# EAGLE design ADC_Block (EAGLE 7.2.0)

## Sheet 1 of 2
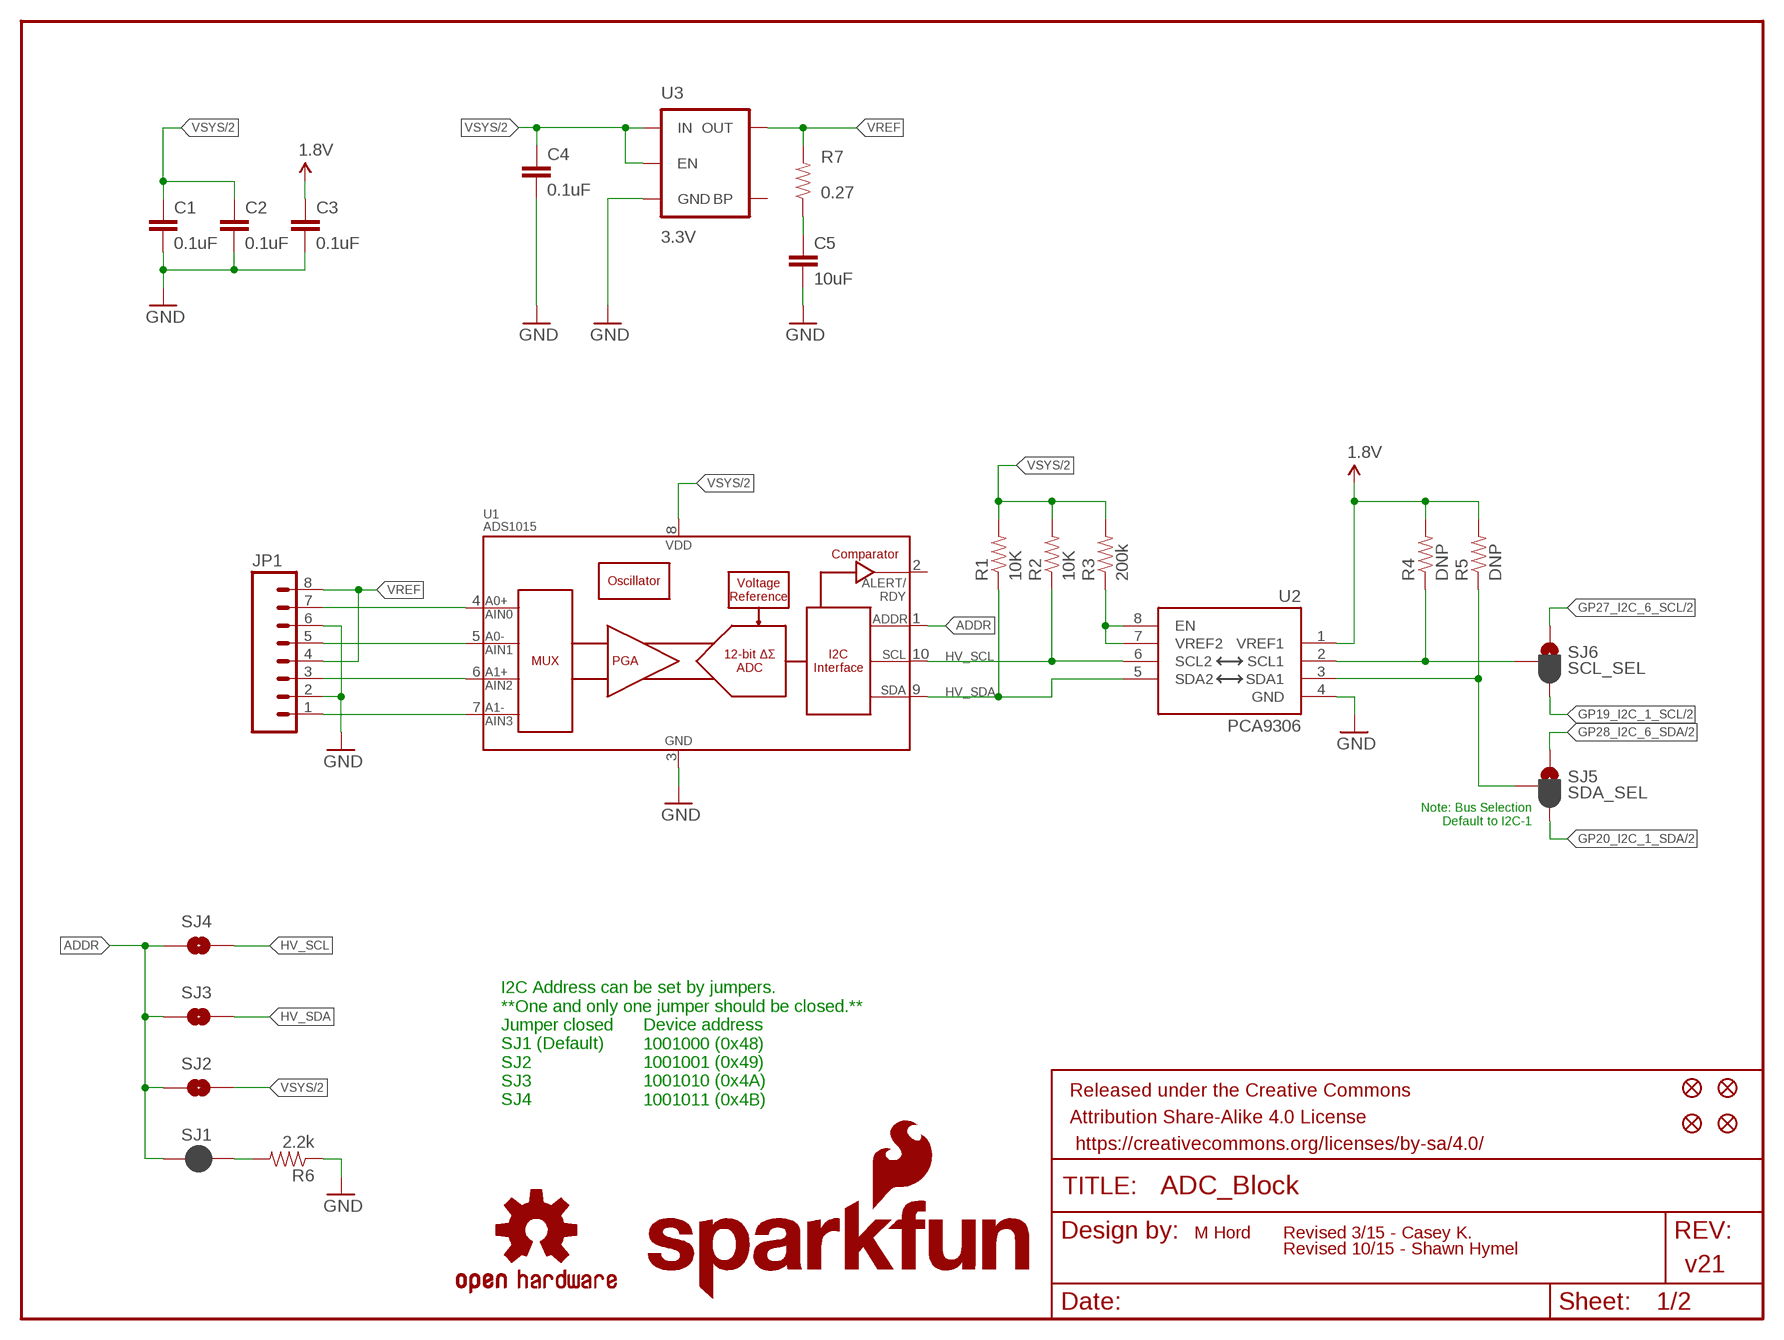
[diagram p0: schematic, sheet 1]

### Parts
C1  0.1uF  0.1UF-25V(+80/-20%)(0603)  [0603-CAP]
C2  0.1uF  0.1UF-25V(+80/-20%)(0603)  [0603-CAP]
C3  0.1uF  0.1UF-25V(+80/-20%)(0603)  [0603-CAP]
C4  0.1uF  0.1UF-25V(+80/-20%)(0603)  [0603-CAP]
C5  10uF  10UF10V10%(0805)  [0805-CAP]
FID1  FIDUCIAL1X2  [FIDUCIAL-1X2]
FID2  FIDUCIAL1X2  [FIDUCIAL-1X2]
FID3  FIDUCIAL1X2  [FIDUCIAL-1X2]
FID4  FIDUCIAL1X2  [FIDUCIAL-1X2]
FRAME1  FRAME-LETTER  [CREATIVE_COMMONS]
JP1  M08LOCK  [1X08_LOCK]
LOGO1  SFE_LOGO_NAME_FLAME.1_INCH  [SFE_LOGO_NAME_FLAME_.1]
LOGO2  OSHW-LOGOS  [OSHW-LOGO-S]
LOGO3  SFE_LOGO_NAME_FLAME.1_INCH  [SFE_LOGO_NAME_FLAME_.1]
LOGO4  OSHW-LOGOS  [OSHW-LOGO-S]
R1  10K  10KOHM-1/10W-1%(0603)0603  [0603-RES]
R2  10K  10KOHM-1/10W-1%(0603)0603  [0603-RES]
R3  200k  200KOHM1/10W1%(0603)200K  [0603-RES]
R4  DNP  2.2KOHM-1/10W-1%(0603)  [0603-RES]
R5  DNP  2.2KOHM-1/10W-1%(0603)  [0603-RES]
R6  2.2k  2.2KOHM-1/10W-1%(0603)  [0603-RES]
R7  0.27  0.27OHM-1/10W-1%(0603)  [0603-RES]
SJ1  JUMPER-PAD-2-NC_BY_PASTE  [PAD-JUMPER-2-NC_BY_PASTE_YES_SILK]
SJ2  JUMPER-PAD-2-NOYES_SILK  [PAD-JUMPER-2-NO_YES_SILK]
SJ3  JUMPER-PAD-2-NOYES_SILK  [PAD-JUMPER-2-NO_YES_SILK]
SJ4  JUMPER-PAD-2-NOYES_SILK  [PAD-JUMPER-2-NO_YES_SILK]
SJ5  SDA_SEL  JUMPER-PAD-3-2OF3_NC_BY_PASTE  [PAD-JUMPER-3-2OF3_NC_BY_PASTE_YES_SILK_FULL_BOX]
SJ6  SCL_SEL  JUMPER-PAD-3-2OF3_NC_BY_PASTE  [PAD-JUMPER-3-2OF3_NC_BY_PASTE_YES_SILK_FULL_BOX]
U1  ADS1015  [MSOP10]
U2  PCA9306  PCA9306PCA9306DC-1:1  [PCA9306DC-1:1]
U3  3.3V  MIC52053.3V  [SOT23-5]

### Nets
1.8V: C3.1 R4.2 R5.2 U2.1(VREF1) ; also sheet 2
A0+/AIN0: JP1.7 U1.4(AIN0)
A0-/AIN1: JP1.5 U1.5(AIN1)
A1+/AIN2: JP1.3 U1.6(AIN2)
A1-/AIN3: JP1.1 U1.7(AIN3)
ADDR: SJ1.1 SJ2.1 SJ3.1 SJ4.1 U1.1(ADDR)
GND: C1.2 C2.2 C3.2 C4.2 C5.2 JP1.2 JP1.6 R6.1 U1.3(VSS) U2.4(GND) U3.2(GND) ; also sheet 2
GP19_I2C_1_SCL: SJ6.3 ; also sheet 2
GP20_I2C_1_SDA: SJ5.3 ; also sheet 2
GP27_I2C_6_SCL: SJ6.1 ; also sheet 2
GP28_I2C_6_SDA: SJ5.1 ; also sheet 2
HV_SCL: R2.1 SJ4.2 U1.10(SCL) U2.6(SCL2)
HV_SDA: R1.1 SJ3.2 U1.9(SDA) U2.5(SDA2)
N$1: R3.1 U2.7(VREF2) U2.8(EN)
N$2: R4.1 SJ6.2 U2.2(SCL1)
N$3: R6.2 SJ1.2
N$4: R5.1 SJ5.2 U2.3(SDA1)
N$5: C5.1 R7.1
VREF: JP1.4 JP1.8 R7.2 U3.5(OUT)
VSYS: C1.1 C2.1 C4.1 R1.2 R2.2 R3.2 SJ2.2 U1.8(VDD) U3.1(IN) U3.3(EN) ; also sheet 2
Unconnected: U1.2(ALERT/RDY) U3.4(BP)

### Notes on the sheet
- Note: Bus Selection
  Default to I2C-1
- I2C Address can be set by jumpers.
  **One and only one jumper should be closed.**
  Jumper closed
  SJ1 (Default)
  SJ2
  SJ3
  SJ4
- Device address
  1001000 (0x48)
  1001001 (0x49)
  1001010 (0x4A)
  1001011 (0x4B)
- M Hord | Revised 3/15 - Casey K.
- Revised 10/15 - Shawn Hymel
- v21

## Sheet 2 of 2
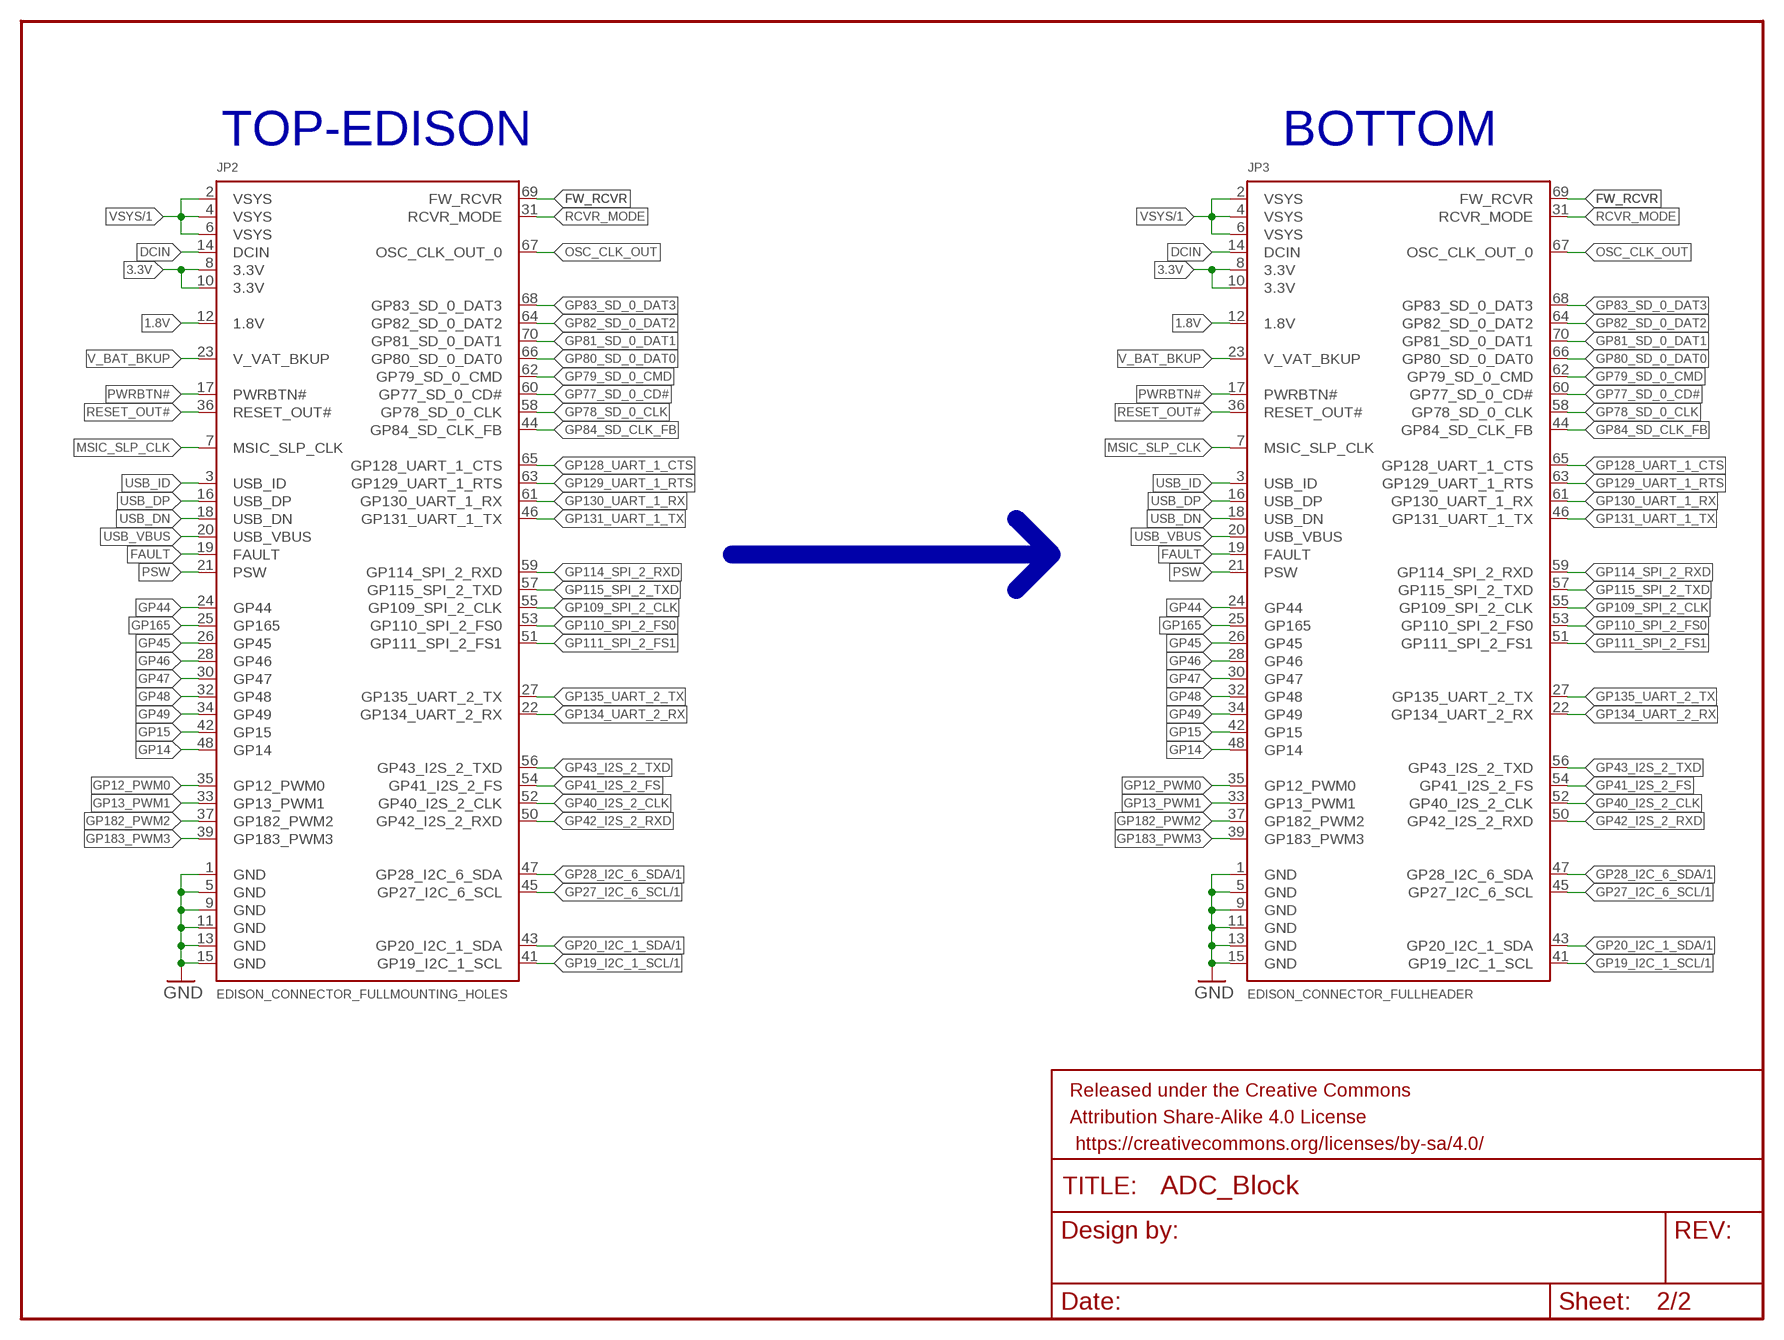
[diagram p1: schematic, sheet 2]

### Parts
FRAME2  FRAME-LETTER  [CREATIVE_COMMONS]
JP2  EDISON_CONNECTOR_FULLMOUNTING_HOLES  [EDISON_DAUGHTER]
JP3  EDISON_CONNECTOR_FULLHEADER  [DF40C-70DP-0.4(51)]

### Nets
1.8V: JP2.12(1.8V) JP3.12(1.8V) ; also sheet 1
3.3V: JP2.8(3.3V) JP2.10(3.3V) JP3.8(3.3V) JP3.10(3.3V)
DCIN: JP2.14(DCIN) JP3.14(DCIN)
FAULT: JP2.19(FAULT) JP3.19(FAULT)
FW_RCVR: JP2.69(FW_RCVR) JP3.69(FW_RCVR)
GND: JP2.1(GND) JP2.5(GND) JP2.9(GND) JP2.11(GND) JP2.13(GND) JP2.15(GND) JP3.1(GND) JP3.5(GND) JP3.9(GND) JP3.11(GND) JP3.13(GND) JP3.15(GND) ; also sheet 1
GP12_PWM0: JP2.35(GP12_PWM0) JP3.35(GP12_PWM0)
GP13_PWM1: JP2.33(GP13_PWM1) JP3.33(GP13_PWM1)
GP14: JP2.48(GP14) JP3.48(GP14)
GP15: JP2.42(GP15) JP3.42(GP15)
GP19_I2C_1_SCL: JP2.41(GP19_I2C_1_SCL) JP3.41(GP19_I2C_1_SCL) ; also sheet 1
GP20_I2C_1_SDA: JP2.43(GP20_I2C_1_SDA) JP3.43(GP20_I2C_1_SDA) ; also sheet 1
GP27_I2C_6_SCL: JP2.45(GP27_I2C_6_SCL) JP3.45(GP27_I2C_6_SCL) ; also sheet 1
GP28_I2C_6_SDA: JP2.47(GP28_I2C_6_SDA) JP3.47(GP28_I2C_6_SDA) ; also sheet 1
GP40_I2S_2_CLK: JP2.52(GP40_I2S_2_CLK) JP3.52(GP40_I2S_2_CLK)
GP41_I2S_2_FS: JP2.54(GP41_I2S_2_FS) JP3.54(GP41_I2S_2_FS)
GP42_I2S_2_RXD: JP2.50(GP42_I2S_2_RXD) JP3.50(GP42_I2S_2_RXD)
GP43_I2S_2_TXD: JP2.56(GP43_I2S_2_TXD) JP3.56(GP43_I2S_2_TXD)
GP44: JP2.24(GP44) JP3.24(GP44)
GP45: JP2.26(GP45) JP3.26(GP45)
GP46: JP2.28(GP46) JP3.28(GP46)
GP47: JP2.30(GP47) JP3.30(GP47)
GP48: JP2.32(GP48) JP3.32(GP48)
GP49: JP2.34(GP49) JP3.34(GP49)
GP77_SD_0_CD#: JP2.60(GP77_SD_0_CD#) JP3.60(GP77_SD_0_CD#)
GP78_SD_0_CLK: JP2.58(GP78_SD_0_CLK) JP3.58(GP78_SD_0_CLK)
GP79_SD_0_CMD: JP2.62(GP79_SD_0_CMD) JP3.62(GP79_SD_0_CMD)
GP80_SD_0_DAT0: JP2.66(GP80_SD_0_DAT0) JP3.66(GP80_SD_0_DAT0)
GP81_SD_0_DAT1: JP2.70(GP81_SD_0_DAT1) JP3.70(GP81_SD_0_DAT1)
GP82_SD_0_DAT2: JP2.64(GP82_SD_0_DAT2) JP3.64(GP82_SD_0_DAT2)
GP83_SD_0_DAT3: JP2.68(GP83_SD_0_DAT3) JP3.68(GP83_SD_0_DAT3)
GP84_SD_CLK_FB: JP2.44(GP84_SD_CLK_FB) JP3.44(GP84_SD_CLK_FB)
GP109_SPI_2_CLK: JP2.55(GP109_SPI_2_CLK) JP3.55(GP109_SPI_2_CLK)
GP110_SPI_2_FS0: JP2.53(GP110_SPI_2_FS0) JP3.53(GP110_SPI_2_FS0)
GP111_SPI_2_FS1: JP2.51(GP111_SPI_2_FS1) JP3.51(GP111_SPI_2_FS1)
GP114_SPI_2_RXD: JP2.59(GP114_SPI_2_RXD) JP3.59(GP114_SPI_2_RXD)
GP115_SPI_2_TXD: JP2.57(GP115_SPI_2_TXD) JP3.57(GP115_SPI_2_TXD)
GP128_UART_1_CTS: JP2.65(GP128_UART_1_CTS) JP3.65(GP128_UART_1_CTS)
GP129_UART_1_RTS: JP2.63(GP129_UART_1_RTS) JP3.63(GP129_UART_1_RTS)
GP130_UART_1_RX: JP2.61(GP130_UART_1_RX) JP3.61(GP130_UART_1_RX)
GP131_UART_1_TX: JP2.46(GP131_UART_1_TX) JP3.46(GP131_UART_1_TX)
GP134_UART_2_RX: JP2.22(GP134_UART_2_RX) JP3.22(GP134_UART_2_RX)
GP135_UART_2_TX: JP2.27(GP135_UART_2_TX) JP3.27(GP135_UART_2_TX)
GP165: JP2.25(GP165) JP3.25(GP165)
GP182_PWM2: JP2.37(GP182_PWM2) JP3.37(GP182_PWM2)
GP183_PWM3: JP2.39(GP183_PWM3) JP3.39(GP183_PWM3)
MSIC_SLP_CLK: JP2.7(MSIC_SLP_CLK) JP3.7(MSIC_SLP_CLK)
OSC_CLK_OUT: JP2.67(OSC_CLK_OUT_0) JP3.67(OSC_CLK_OUT_0)
PSW: JP2.21(PSW) JP3.21(PSW)
PWRBTN#: JP2.17(PWRBTN#) JP3.17(PWRBTN#)
RCVR_MODE: JP2.31(RCVR_MODE) JP3.31(RCVR_MODE)
RESET_OUT#: JP2.36(RESET_OUT#) JP3.36(RESET_OUT#)
USB_DN: JP2.18(USB_DN) JP3.18(USB_DN)
USB_DP: JP2.16(USB_DP) JP3.16(USB_DP)
USB_ID: JP2.3(USB_ID) JP3.3(USB_ID)
USB_VBUS: JP2.20(USB_VBUS) JP3.20(USB_VBUS)
V_BAT_BKUP: JP2.23(V_VAT_BKUP) JP3.23(V_VAT_BKUP)
VSYS: JP2.2(VSYS) JP2.4(VSYS) JP2.6(VSYS) JP3.2(VSYS) JP3.4(VSYS) JP3.6(VSYS) ; also sheet 1

### Buses
B$1

### Notes on the sheet
- TOP-EDISON | BOTTOM

## Library data of the parts
C1-C4 = SparkFun-Capacitors:0.1UF-25V(+80/-20%)(0603): CAP-00810 Ceramic Standard decoupling cap; PROD_ID: CAP-00810
C5 = SparkFun-Capacitors:10UF10V10%(0805): CAP-11330; PROD_ID: CAP-11330
FID1-FID4 = SparkFun-Aesthetics:FIDUCIAL: Fiducial Alignment Points Various fiducial points for machine vision alignment.
FRAME1 FRAME2 = SparkFun-Aesthetics:FRAME-LETTER: Schematic Frame Standard 8.5x11 US Letter frame
JP1 = SparkFun-Connectors:M08: Header 8 Standard 8-pin 0.1" header. Use with straight break away headers (SKU : PRT-00116), right angle break away headers (PRT-00553), swiss pins (PRT-00743), machine pins (PRT-00117), and female headers (PRT-00115).
JP2 JP3 = SparkFun-Boards:EDISON_CONNECTOR_FULL
LOGO1 LOGO3 = SparkFun-Aesthetics:SFE_LOGO_NAME_FLAME: SFE Logo, name and flame This is the SparkFun full logo. The logo on the schematic will always be the same size; the package variant is the height of the flame part of the logo. Default layer for the logo on the board is tSilk.
LOGO2 LOGO4 = SparkFun-Aesthetics:OSHW-LOGO: Open Source Hardware Logo This logo indicates the piece of hardware it is found on incorporates a OSHW license and/or adheres to the definition of open source hardware found here: http://freedomdefined.org/OSHW
R1 R2 = SparkFun-Resistors:10KOHM-1/10W-1%(0603): RES-00824; PROD_ID: RES-00824
R3 = SparkFun-Resistors:200KOHM1/10W1%(0603): RES-09385; PROD_ID: RES-09385
R4 R5 = SparkFun-Resistors:2.2KOHM-1/10W-1%(0603): RES-08272; PROD_ID: RES-08272; VALUE: 2.2k
R6 = SparkFun-Resistors:2.2KOHM-1/10W-1%(0603): RES-08272; PROD_ID: RES-08272
R7 = SparkFun-Resistors:0.27OHM-1/10W-1%(0603): RES-08787; PROD_ID: RES-08787
SJ1 = SparkFun-Passives:JUMPER-PAD-2-NC_BY_PASTE
SJ2-SJ4 = SparkFun-Passives:JUMPER-PAD-2-NO
SJ5 SJ6 = SparkFun-Passives:JUMPER-PAD-3-2OF3_NC_BY_PASTE
U1 = SparkFun-AnalogIC:ADS1015: 12-Bit Del-Sig ADC Four single-ended inputs or two differential inputs Internal PGA I2C interface 2.0-5.5V; PROD_ID: IC-12239
U2 = SparkFun-DigitalIC:PCA9306: Bidirectional I2C level shifter. NOT compatible with all available part number pinout schemes- DOUBLE CHECK!!!; PROD_ID: IC-10023
U3 = SparkFun-PowerIC:MIC5205: MIC5205 150mA vreg 3.3V - VREG-00822 5V - VREG-00823; PROD_ID: VREG-00822

## Board
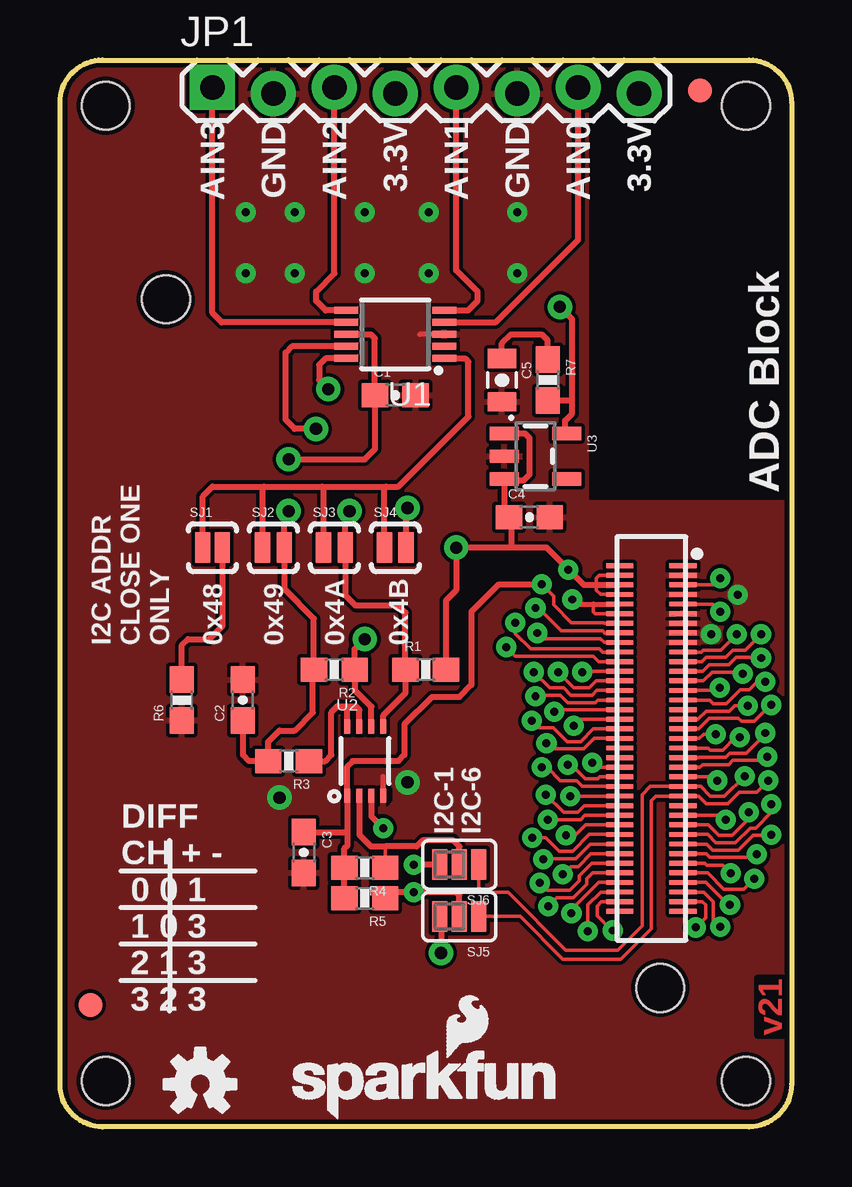
[diagram p2: board, top side]
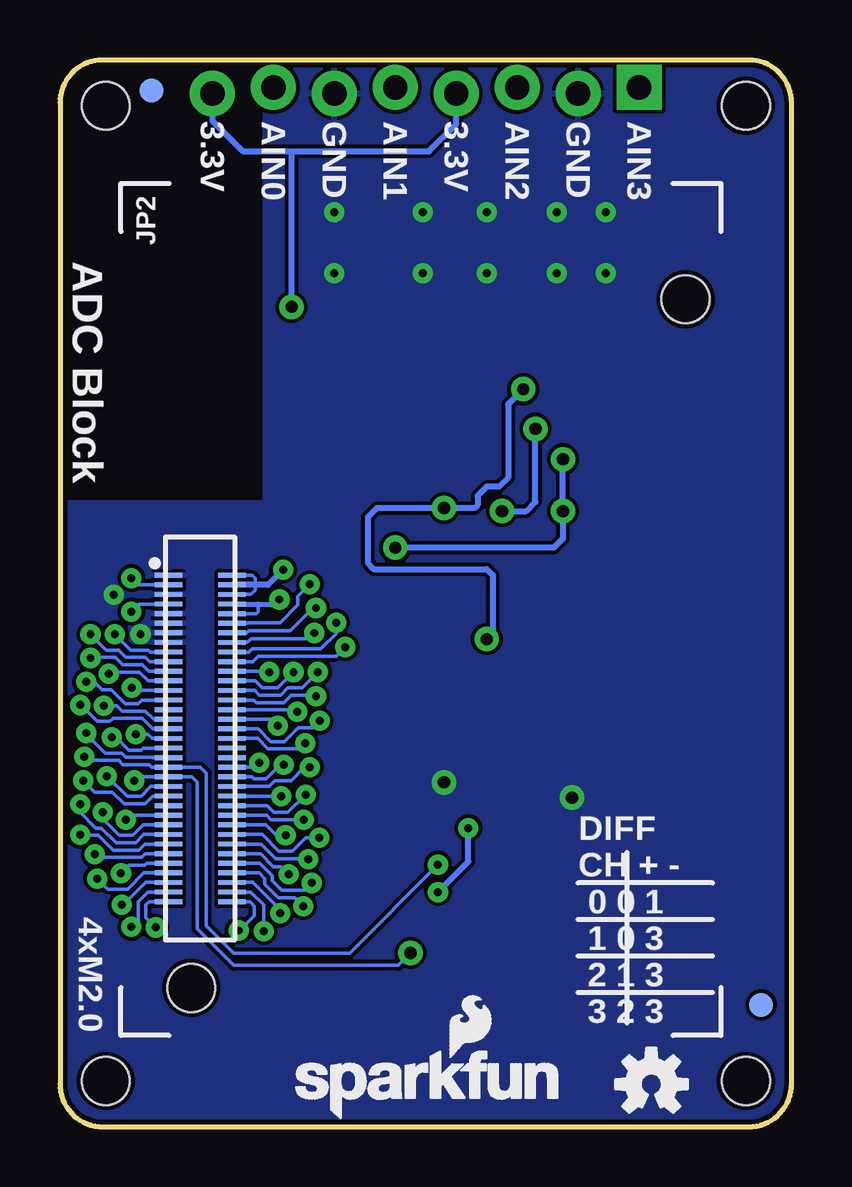
[diagram p3: board, bottom side, seen from below]

Size 30.48 x 44.45 mm. Coordinates in mm from the lower left corner, seen from the top.
Outline: 30.48,42.67 30.48,1.78 arc-90 28.7,0 1.78,0 arc-90 0,1.78 0,42.67 arc-90 1.78,44.45 28.7,44.45 arc-90 30.48,42.67
Copper layers (1*16): Top 0.035mm / dielectric 1.5mm / Bottom 0.035mm
Design rules "Casey_Edison-2-Layer": minimum track width 6mil, minimum drill 13mil, track to track 6mil, track to pad 6mil, pad to pad 6mil, via to via 6mil, smd to smd 6mil, copper to edge 8mil, drill to drill 8mil, minimum pad ring 12mil, minimum via ring 10mil, stop-mask expansion 4mil, vias tented up to drill 20mil, thermal gap 6mil
Holes 2 mm at 28.57,1.91 1.91,1.91 1.91,42.55 28.57,42.55
tRestrict: area 22.1,26.2 to 30.5,44.5; 2 lines
bRestrict: area 22.1,26.2 to 30.5,44.5

### Footprints (pad centres in the part's own frame; a part is rotated, then mirrored left to right if it is on the bottom)
0603-CAP = smd 1.1 x 1: 1 -0.85,0; 2 0.85,0
0805-CAP = smd 0.8 x 1.2: 1 -0.9,0; 2 0.9,0
FIDUCIAL-1X2 = smd 1 x 1: 1 0,0
1X08_LOCK = drill 1.016 pad 1.88 square: 1 0,0.127 | drill 1.016 pad 1.88: 2 2.54,-0.127; 3 5.08,0.127; 4 7.62,-0.127; 5 10.16,0.127; 6 12.7,-0.127; 7 15.24,0.127; 8 17.78,-0.127
EDISON_DAUGHTER = smd 1.14 x 0.2: 1 1.98,19.17; 2 4.62,19.17; 3 1.98,18.77; 4 4.62,18.77; 5 1.98,18.37; 6 4.62,18.37; 7 1.98,17.97; 8 4.62,17.97; 9 1.98,17.57; 10 4.62,17.57; 11 1.98,17.17; 12 4.62,17.17; 13 1.98,16.77; 14 4.62,16.77; 15 1.98,16.37; 16 4.62,16.37; 17 1.98,15.97; 18 4.62,15.97; 19 1.98,15.57; 20 4.62,15.57; 21 1.98,15.17; 22 4.62,15.17; 23 1.98,14.77; 24 4.62,14.77; 25 1.98,14.37; 26 4.62,14.37; 27 1.98,13.97; 28 4.62,13.97; 29 1.98,13.57; 30 4.62,13.57; 31 1.98,13.17; 32 4.62,13.17; 33 1.98,12.77; 34 4.62,12.77; 35 1.98,12.37; 36 4.62,12.37; 37 1.98,11.97; 38 4.62,11.97; 39 1.98,11.57; 40 4.62,11.57; 41 1.98,11.17; 42 4.62,11.17; 43 1.98,10.77; 44 4.62,10.77; 45 1.98,10.37; 46 4.62,10.37; 47 1.98,9.97; 48 4.62,9.97; 49 1.98,9.57; 50 4.62,9.57; 51 1.98,9.17; 52 4.62,9.17; 53 1.98,8.77; 54 4.62,8.77; 55 1.98,8.37; 56 4.62,8.37; 57 1.98,7.97; 58 4.62,7.97; 59 1.98,7.57; 60 4.62,7.57; 61 1.98,7.17; 62 4.62,7.17; 63 1.98,6.77; 64 4.62,6.77; 65 1.98,6.37; 66 4.62,6.37; 67 1.98,5.97; 68 4.62,5.97; 69 1.98,5.57; 70 4.62,5.57 | hole 2: 23.53,30.67; 2.93,1.98
DF40C-70DP-0.4(51) = smd 0.2 x 1.14 bottom: 1 6.8,1.32; 2 6.8,-1.32; 3 6.4,1.32; 4 6.4,-1.32; 5 6,1.32; 6 6,-1.32; 7 5.6,1.32; 8 5.6,-1.32; 9 5.2,1.32; 10 5.2,-1.32; 11 4.8,1.32; 12 4.8,-1.32; 13 4.4,1.32; 14 4.4,-1.32; 15 4,1.32; 16 4,-1.32; 17 3.6,1.32; 18 3.6,-1.32; 19 3.2,1.32; 20 3.2,-1.32; 21 2.8,1.32; 22 2.8,-1.32; 23 2.4,1.32; 24 2.4,-1.32; 25 2,1.32; 26 2,-1.32; 27 1.6,1.32; 28 1.6,-1.32; 29 1.2,1.32; 30 1.2,-1.32; 31 0.8,1.32; 32 0.8,-1.32; 33 0.4,1.32; 34 0.4,-1.32; 35 0,1.32; 36 0,-1.32; 37 -0.4,1.32; 38 -0.4,-1.32; 39 -0.8,1.32; 40 -0.8,-1.32; 41 -1.2,1.32; 42 -1.2,-1.32; 43 -1.6,1.32; 44 -1.6,-1.32; 45 -2,1.32; 46 -2,-1.32; 47 -2.4,1.32; 48 -2.4,-1.32; 49 -2.8,1.32; 50 -2.8,-1.32; 51 -3.2,1.32; 52 -3.2,-1.32; 53 -3.6,1.32; 54 -3.6,-1.32; 55 -4,1.32; 56 -4,-1.32; 57 -4.4,1.32; 58 -4.4,-1.32; 59 -4.8,1.32; 60 -4.8,-1.32; 61 -5.2,1.32; 62 -5.2,-1.32; 63 -5.6,1.32; 64 -5.6,-1.32; 65 -6,1.32; 66 -6,-1.32; 67 -6.4,1.32; 68 -6.4,-1.32; 69 -6.8,1.32; 70 -6.8,-1.32; NC1 7.2,1.32; NC2 7.2,-1.32; NC3 -7.2,-1.32; NC4 -7.2,1.32
0603-RES = smd 1.1 x 1: 1 -0.85,0; 2 0.85,0
PAD-JUMPER-2-NC_BY_PASTE_YES_SILK = smd 0.635 x 1.27: 1 -0.401,0; 2 0.413,0
PAD-JUMPER-2-NO_YES_SILK = smd 0.635 x 1.27: 1 -0.45,0; 2 0.45,0
PAD-JUMPER-3-2OF3_NC_BY_PASTE_YES_SILK_FULL_BOX = smd 0.635 x 1.27: 1 -0.813,0; 2 0,0; 3 0.813,0
MSOP10 = smd 0.3 x 1: 1 -1,-2.05; 2 -0.5,-2.05; 3 0,-2.05; 4 0.5,-2.05; 5 1,-2.05; 6 1,2.05; 7 0.5,2.05; 8 0,2.05; 9 -0.5,2.05; 10 -1,2.05
PCA9306DC-1:1 = smd 0.25 x 0.602: 1 -0.73,-1.446; 2 -0.23,-1.446; 3 0.27,-1.446; 4 0.77,-1.446; 5 0.77,1.431; 6 0.27,1.431; 7 -0.23,1.431; 8 -0.73,1.431
SOT23-5 = smd 0.55 x 1.2: 1 -0.95,-1.3; 2 0,-1.3; 3 0.95,-1.3; 4 0.95,1.3; 5 -0.95,1.3

### Placement (x,y rotation side)
C1  13.97,30.48 0 top
C2  7.62,17.78 90 top
C3  10.16,11.43 270 top
C4  19.56,25.4 0 top
C5  18.41,31.11 270 top
FID1  1.27,5.08 0 top
FID2  26.67,43.18 0 top
FID3  26.67,43.18 0 bottom
FID4  1.27,5.08 0 bottom
FRAME1  -1.27,-13.97 0 top  (outside the outline)
FRAME2  -1.27,-13.97 0 top  (outside the outline)
JP1  6.35,43.18 0 top
JP2  27.94,3.81 0 bottom
JP3  24.64,16.18 90 bottom
LOGO1  9.27,0.25 0 top
LOGO2  5.84,1.78 0 bottom
LOGO3  21.08,0.25 0 bottom
LOGO4  5.84,1.78 0 top
R1  15.24,19.05 0 top
R2  11.43,19.05 180 top
R3  9.53,15.24 180 top
R4  12.7,10.79 180 top
R5  12.7,9.53 180 top
R6  5.08,17.78 90 top
R7  20.32,31.11 270 top
SJ1  6.35,24.13 0 top
SJ2  8.89,24.13 0 top
SJ3  11.43,24.13 0 top
SJ4  13.97,24.13 0 top
SJ5  16.64,8.76 180 top
SJ6  16.64,10.92 180 top
U1  13.97,33.02 90 top
U2  12.7,15.24 0 top
U3  19.81,27.94 270 top

### Tracks (layer width: path | path; a pad name or v marks a point on that pad's centre or on a via)
1.8V  (via drill 0.33)
  Top 0.152: JP3.12 22.68,20.98 22.66,21.01 21.31,21.01 20.57,21.74 20.57,22.1 v20.07,22.61
  Top 0.254: R5.2 R4.2 11.85,11.6 11.97,11.72 11.97,12.19 | 11.97,12.19 U2.1 11.97,15.02 12.19,15.24 14.1,15.24 14.35,15.49 14.35,16.76 15.49,17.91 16.64,17.91 17.14,18.41 17.14,21.46 18.29,22.61 v20.07,22.61 | C3.1 11.88,12.28 11.97,12.19
  Bottom 0.152: v20.07,22.61 20.57,22.1 20.57,21.74 21.31,21.01 22.66,21.01 22.68,20.98 JP3.12
3.3V  (via drill 0.33)
  Top 0.152: JP3.10 22.31,21.38 22.23,21.46 22.23,21.78
  Top 0.203: v21.34,21.97 21.53,21.78 22.23,21.78 JP3.8
  Bottom 0.152: JP3.10 22.31,21.38 22.23,21.46 22.23,21.78 | JP3.8
  Bottom 0.203: JP3.8 22.23,21.78 21.53,21.78 v21.34,21.97
A0+/AIN0
  Top 0.254: U1.4 18.16,33.53 21.59,36.96 JP1.7
A0-/AIN1
  Top 0.254: U1.5 17,34.02 17.4,34.42 17.4,34.8 16.51,35.69 JP1.5
A1+/AIN2
  Top 0.254: U1.6 11.06,34.02 10.67,34.42 10.67,34.8 11.43,35.56 JP1.3
A1-/AIN3
  Top 0.254: U1.7 6.74,33.52 6.35,33.91 JP1.1
ADDR
  Top 0.254: SJ1.1 5.95,26.27 6.35,26.67 8.51,26.67 | 8.51,26.67 10.92,26.67 | 10.92,26.67 13.59,26.67 | 13.59,26.67 14.1,26.67 17.02,29.59 17.02,31.88 16.88,32.02 U1.1 | SJ2.1 8.44,26.6 8.51,26.67 | SJ3.1 10.98,26.61 10.92,26.67 | SJ4.1 13.52,26.6 13.59,26.67
DCIN  (via drill 0.33)
  Top 0.152: v19.81,21.61 19.94,21.61 20.88,20.68 22.61,20.68 22.71,20.57 JP2.14
  Bottom 0.152: JP2.14 22.7,20.58 22.61,20.68 20.88,20.68 19.94,21.61 v19.81,21.61
FAULT  (via drill 0.33)
  Top 0.152: JP3.19 26.75,19.38 26.92,19.56 27.74,19.56 28.04,19.86 28.55,19.86 v29.21,20.52
  Bottom 0.152: v29.21,20.52 28.55,19.86 28.04,19.86 27.74,19.56 26.92,19.56 26.75,19.38 JP3.19
FW_RCVR  (via drill 0.33)
  Top 0.152: v26.49,8.31 26.9,8.71 26.9,9.25 26.76,9.38 JP3.69
  Bottom 0.152: JP3.69 26.76,9.38 26.9,9.25 26.9,8.71 v26.49,8.31
GND  (via drill 0.33, 0.51)
  Top 0.203: U2.4 13.46,14.61 | U1.3 14.99,33.02
  other vias: 27.13,20.52 28.24,22.17 14.48,14.35 19.05,35.56 12.7,35.56 19.05,38.1 12.7,38.1 15.37,38.1 15.37,35.56 9.78,35.56 9.78,38.1 7.75,38.1 7.75,35.56 9.14,13.72
  pour Bottom (isolate 0.051, rank 6): 30.48,42.67 30.48,1.78 arc-90 28.7,0 1.78,0 arc-90 0,1.78 0,42.67 arc-90 1.78,44.45 28.7,44.45 arc-90
  pour Top (isolate 0.051, rank 6): 30.48,1.73 arc-90 28.75,0 1.78,0 arc-90 0,1.78 0,42.67 arc-90 1.78,44.45 28.7,44.45 arc-90 30.48,42.67
GP12_PWM0  (via drill 0.33)
  Top 0.152: JP3.35 26.64,16.18 26.82,16.36 v27.33,16.36
  Bottom 0.152: v27.33,16.36 26.82,16.36 26.64,16.18 JP3.35 | JP3.35
GP13_PWM1  (via drill 0.33)
  Top 0.152: v29.64,17.58 29.62,17.58 28.93,16.89 28.4,16.89 28.27,17.02 27.05,17.02 26.61,16.58 JP3.33
  Bottom 0.152: JP3.33 26.61,16.58 27.05,17.02 28.27,17.02 28.4,16.89 28.93,16.89 29.62,17.58 v29.64,17.58
GP14  (via drill 0.33)
  Top 0.152: v21.26,13.77 21.27,13.78 JP3.48
  Bottom 0.152: JP3.48 21.27,13.78 v21.26,13.77
GP15  (via drill 0.33)
  Top 0.152: JP3.42 22.36,14.98 v22.17,15.16
  Bottom 0.152: v22.17,15.16 22.36,14.98 JP3.42
GP19_I2C_1_SCL  (via drill 0.33)
  Top 0.152: JP3.41 26.66,14.98 26.77,15.09 27.86,15.09 28.04,15.27 29.31,15.27 v29.46,15.42
  Top 0.254: SJ6.3 v14.73,10.92
  Bottom 0.152: v29.46,15.42 29.31,15.27 28.04,15.27 27.86,15.09 26.77,15.09 26.66,14.98 JP3.41 24.63,14.98 24.38,14.73 24.38,8.38 23.24,7.24 18.41,7.24 v14.73,10.92
GP20_I2C_1_SDA  (via drill 0.33, 0.51)
  Top 0.152: JP3.43 27.23,14.58 v27.38,14.43 | SJ5.3 15.88,8.71
  Top 0.254: 15.88,8.71 v15.88,7.24
  Bottom 0.152: v27.38,14.43 27.23,14.58 JP3.43 | JP3.43 | v15.88,7.24 16.38,6.73 23.24,6.73 24.77,8.26 24.77,14.35 24.99,14.58 JP3.43
GP27_I2C_6_SCL  (via drill 0.33)
  Top 0.152: v28.52,14.61 27.69,13.77 27.1,13.77 26.69,14.18 JP3.45 24.59,14.18 24.26,13.84 24.26,8.38 23.24,7.37 21.08,7.37 18.67,9.78 17.65,9.78 17.45,9.98 SJ6.1
  Bottom 0.152: JP3.45 26.69,14.18 27.1,13.77 27.69,13.77 v28.52,14.61
GP28_I2C_6_SDA  (via drill 0.33)
  Top 0.152: v29.52,14.43 29.03,13.95 28.3,13.95 27.81,13.46 26.92,13.46 26.61,13.78 26.04,13.78 JP3.47 24.83,13.78 24.64,13.59 24.64,8.26 23.37,6.99 20.95,6.99 19.18,8.76 SJ5.1
  Bottom 0.152: v29.52,14.43 29.03,13.95 28.3,13.95 27.81,13.46 26.92,13.46 26.61,13.78 JP3.47
GP40_I2S_2_CLK  (via drill 0.33)
  Top 0.152: JP3.52 21.87,12.98 21.69,12.8 v20.32,12.8
  Bottom 0.152: v20.32,12.8 21.69,12.8 21.87,12.98 JP3.52
GP41_I2S_2_FS  (via drill 0.33)
  Top 0.152: v21.08,12.14 21.46,12.14 21.9,12.58 JP3.54
  Bottom 0.152: JP3.54 21.9,12.58 21.46,12.14 v21.08,12.14
GP42_I2S_2_RXD  (via drill 0.33)
  Top 0.152: JP3.50 21.84,13.38 21.57,13.11 20.98,13.11 v20.24,13.84
  Bottom 0.152: v20.24,13.84 20.98,13.11 21.57,13.11 21.84,13.38 JP3.50
GP43_I2S_2_TXD  (via drill 0.33)
  Top 0.152: JP3.56 22.06,12.18 21.36,11.48 20.8,11.48 20.24,12.04 v19.68,12.04
  Bottom 0.152: v19.68,12.04 20.24,12.04 20.8,11.48 21.36,11.48 22.06,12.18 JP3.56
GP44  (via drill 0.33)
  Top 0.152: JP3.24 22.34,18.58 22.05,18.29 21.41,18.29 v20.75,18.95
  Bottom 0.152: v20.75,18.95 21.41,18.29 22.05,18.29 22.34,18.58 JP3.24
GP45  (via drill 0.33)
  Top 0.152: v19.74,18.95 20.4,18.29 20.98,18.29 21.29,17.98 22.17,17.98 22.37,18.18 JP3.26
  Bottom 0.152: JP3.26 22.37,18.18 22.17,17.98 21.29,17.98 20.98,18.29 20.4,18.29 v19.74,18.95
GP46  (via drill 0.33)
  Top 0.152: JP3.28 22.4,17.78 22.3,17.68 21.16,17.68 20.85,17.98 19.86,17.98 v19.81,17.93
  Bottom 0.152: v19.81,17.93 19.86,17.98 20.85,17.98 21.16,17.68 22.3,17.68 22.4,17.78 JP3.28
GP47  (via drill 0.33)
  Top 0.152: JP3.30 22.43,17.38 22.43,17.37 20.68,17.37 v20.6,17.3
  Bottom 0.152: v20.6,17.3 20.68,17.37 22.43,17.37 22.43,17.38 JP3.30
GP48  (via drill 0.33)
  Top 0.152: v21.41,16.71 21.68,16.98 JP3.32
  Bottom 0.152: JP3.32 21.68,16.98 v21.41,16.71
GP49  (via drill 0.33)
  Top 0.152: JP3.34 22.22,16.58 21.69,16.05 21.13,16.05 20.55,16.64 19.94,16.64 v19.66,16.92
  Bottom 0.152: v19.66,16.92 19.94,16.64 20.55,16.64 21.13,16.05 21.69,16.05 22.22,16.58 JP3.34
GP77_SD_0_CD#  (via drill 0.33)
  Top 0.152: JP3.60 22.12,11.38 21.59,10.85 21.29,10.85 v20.95,10.52
  Bottom 0.152: v20.95,10.52 21.29,10.85 21.59,10.85 22.12,11.38 JP3.60
GP78_SD_0_CLK  (via drill 0.33)
  Top 0.152: JP3.58 22.09,11.78 21.49,11.18 20.17,11.18 v20.14,11.15
  Bottom 0.152: v20.14,11.15 20.17,11.18 21.49,11.18 22.09,11.78 JP3.58
GP79_SD_0_CMD  (via drill 0.33)
  Top 0.152: JP3.62 22.16,10.98 21.64,10.46 21.64,10.26 21.23,9.86 20.3,9.86 v19.99,10.16
  Bottom 0.152: v19.99,10.16 20.3,9.86 21.23,9.86 21.64,10.26 21.64,10.46 22.16,10.98 JP3.62
GP80_SD_0_DAT0  (via drill 0.33)
  Top 0.152: v21.31,8.89 21.31,9.04 22.45,10.18 JP3.66
  Bottom 0.152: JP3.66 22.45,10.18 21.31,9.04 v21.31,8.89
GP81_SD_0_DAT1  (via drill 0.33)
  Top 0.152: JP3.70 22.56,9.38 22.38,9.2 22.38,8.79 22.99,8.18 v23.04,8.18
  Bottom 0.152: v23.04,8.18 22.99,8.18 22.38,8.79 22.38,9.2 22.56,9.38 JP3.70
GP82_SD_0_DAT2  (via drill 0.33)
  Top 0.152: JP3.64 22.19,10.58 21.95,10.34 21.95,10.11 21.39,9.55 20.7,9.55 v20.34,9.2
  Bottom 0.152: v20.34,9.2 20.7,9.55 21.39,9.55 21.95,10.11 21.95,10.34 22.19,10.58 JP3.64
GP83_SD_0_DAT3  (via drill 0.33)
  Top 0.152: v22,8.15 22,9.25 22.53,9.78 JP3.68
  Bottom 0.152: JP3.68 22.53,9.78 22,9.25 v22,8.15
GP84_SD_CLK_FB  (via drill 0.33)
  Top 0.152: JP3.44 22.48,14.58 22.4,14.5 21.89,14.5 21.31,15.09 v21.16,15.09
  Bottom 0.152: v21.16,15.09 21.31,15.09 21.89,14.5 22.4,14.5 22.48,14.58 JP3.44 | JP3.44
GP109_SPI_2_CLK  (via drill 0.33)
  Top 0.152: JP3.55 26.99,12.18 27.33,11.84 28.14,11.84 28.75,12.45 28.98,12.45 29.64,13.11 v29.64,13.44
  Bottom 0.152: v29.64,13.44 29.64,13.11 28.98,12.45 28.75,12.45 28.14,11.84 27.33,11.84 26.99,12.18 JP3.55
GP110_SPI_2_FS0  (via drill 0.33)
  Top 0.152: v28.7,13.11 28.7,12.83 28.02,12.14 27.46,12.14 27.02,12.58 JP3.53
  Bottom 0.152: JP3.53 27.02,12.58 27.46,12.14 28.02,12.14 28.7,12.83 v28.7,13.11
GP111_SPI_2_FS1  (via drill 0.33)
  Top 0.152: v27.74,12.8 27.56,12.98 JP3.51
  Bottom 0.152: JP3.51 27.56,12.98 v27.74,12.8
GP114_SPI_2_RXD  (via drill 0.33)
  Top 0.152: JP3.59 26.92,11.38 27.08,11.23 28.91,11.23 v29.03,11.35
  Bottom 0.152: JP3.59 26.92,11.38 27.08,11.23 28.91,11.23 v29.03,11.35
GP115_SPI_2_TXD  (via drill 0.33)
  Top 0.152: JP3.57 26.95,11.78 27.2,11.53 28.27,11.53 28.88,12.14 29.62,12.14 v29.64,12.17
  Bottom 0.152: JP3.57 26.95,11.78 27.2,11.53 28.27,11.53 28.88,12.14 29.62,12.14 v29.64,12.17
GP128_UART_1_CTS  (via drill 0.33)
  Top 0.152: JP3.65 26.9,10.18 27.84,9.25 v27.91,9.25
  Bottom 0.152: v27.91,9.25 27.84,9.25 26.9,10.18 JP3.65
GP129_UART_1_RTS  (via drill 0.33)
  Top 0.152: v28.93,10.34 28.5,9.91 27.66,9.91 26.99,10.58 JP3.63
  Bottom 0.152: JP3.63 26.99,10.58 27.66,9.91 28.5,9.91 v28.93,10.34
GP130_UART_1_RX  (via drill 0.33)
  Top 0.152: v27.94,10.57 27.61,10.9 26.95,10.9 26.87,10.98 JP3.61
  Bottom 0.152: JP3.61 26.87,10.98 26.95,10.9 27.61,10.9 v27.94,10.57
GP131_UART_1_TX  (via drill 0.33)
  Top 0.152: JP3.46 22.52,14.18 22.5,14.2 21.77,14.2 21.54,14.43 20.85,14.43 20.3,14.99 v20.07,14.99
  Bottom 0.152: v20.07,14.99 20.3,14.99 20.85,14.43 21.54,14.43 21.77,14.2 22.5,14.2 22.52,14.18 JP3.46
GP134_UART_2_RX  (via drill 0.33)
  Top 0.152: v21.77,18.95 21.8,18.98 JP3.22
  Bottom 0.152: JP3.22 21.8,18.98 v21.77,18.95
GP135_UART_2_TX  (via drill 0.33)
  Top 0.152: v29.39,18.54 29.06,18.54 28.73,18.21 28.35,18.21 27.76,17.63 27.23,17.63 27.08,17.78 JP3.27
  Bottom 0.152: JP3.27 27.08,17.78 27.23,17.63 27.76,17.63 28.35,18.21 28.73,18.21 29.06,18.54 v29.39,18.54
GP165  (via drill 0.33)
  Top 0.152: v27.48,18.29 27.38,18.18 JP3.25
  Bottom 0.152: JP3.25 27.38,18.18 v27.48,18.29
GP182_PWM2  (via drill 0.33)
  Top 0.152: JP3.37 27.02,15.78 27.1,15.7 27.61,15.7 28.14,16.23 v28.32,16.23
  Bottom 0.152: v28.32,16.23 28.14,16.23 27.61,15.7 27.1,15.7 27.02,15.78 JP3.37
GP183_PWM3  (via drill 0.33)
  Top 0.152: v29.39,16.41 29.39,16.36 28.6,15.57 27.91,15.57 27.74,15.39 26.62,15.39 26.61,15.38 JP3.39
  Bottom 0.152: JP3.39 26.61,15.38 26.62,15.39 27.74,15.39 27.91,15.57 28.6,15.57 29.39,16.36 v29.39,16.41
HV_SCL  (via drill 0.51)
  Top 0.254: U2.6 12.97,17.51 12.28,18.2 R2.1 12.28,19.9 v12.7,20.32 | U1.10 11.06,32.02 10.79,31.75 10.79,31.11 v11.18,30.73 | SJ4.2 14.42,25.72 v14.48,25.78
  Bottom 0.254: v11.18,30.73 11.81,30.1 11.81,27.05 12.19,26.67 12.7,26.67 13.08,26.29 13.08,25.91 13.21,25.78 v14.48,25.78 17.27,25.78 17.65,25.4 17.65,23.5 17.4,23.24 12.7,23.24 12.45,22.99 12.45,20.57 v12.7,20.32
HV_SDA  (via drill 0.51)
  Top 0.254: U2.5 13.47,17.15 14.39,18.07 R1.1 14.39,21.42 14.1,21.72 12.32,21.72 11.88,22.16 SJ3.2 11.88,25.47 v12.06,25.65 | v10.67,29.08 9.78,29.08 9.4,29.46 9.4,32.26 9.66,32.52 U1.9
  Bottom 0.254: v12.06,25.65 11.05,25.65 10.67,26.04 v10.67,29.08
MSIC_SLP_CLK  (via drill 0.33)
  Top 0.152: v27.51,21.46 27.19,21.78 JP3.7
  Bottom 0.152: JP3.7 27.19,21.78 v27.51,21.46
N$1
  Top 0.254: U2.7 12.47,17.38 12.32,17.53 11.94,17.53 | R3.1 11.05,15.24 11.3,15.49 11.3,17.27 11.56,17.53 11.94,17.53 | U2.8 11.97,17.49 11.94,17.53
N$2
  Top 0.152: 13.55,11.68 R4.1
  Top 0.254: SJ6.2 16.64,11.68 16.38,11.94 15.11,11.94 14.86,11.68 13.55,11.68 12.95,11.68 12.47,12.17 U2.2
N$3
  Top 0.254: R6.2 5.08,20.07 5.33,20.32 6.22,20.32 6.76,20.86 SJ1.2
N$4  (via drill 0.33)
  Top 0.152: 13.8,9.78 R5.1
  Top 0.254: SJ5.2 16.64,9.65 16.51,9.78 v14.73,9.78 13.8,9.78 | U2.3 12.97,12.94 v13.46,12.45
  Bottom 0.254: v14.73,9.78 13.46,11.05 v13.46,12.45
N$5
  Top 0.254: R7.1 20.32,32.77 20.07,33.02 18.8,33.02 18.41,32.64 C5.1
OSC_CLK_OUT  (via drill 0.33)
  Top 0.152: v27.51,8.33 27.23,8.61 27.23,9.37 26.82,9.78 JP3.67
  Bottom 0.152: JP3.67 26.82,9.78 27.23,9.37 27.23,8.61 v27.51,8.33
PSW  (via drill 0.33)
  Top 0.152: v29.21,19.53 29.18,19.56 28.17,19.56 27.86,19.25 27.05,19.25 26.78,18.98 JP3.21
  Bottom 0.152: JP3.21 26.78,18.98 27.05,19.25 27.86,19.25 28.17,19.56 29.18,19.56 v29.21,19.53
PWRBTN#  (via drill 0.33)
  Top 0.152: v28.19,20.52 27.53,19.86 26.8,19.86 26.71,19.78 JP3.17
  Bottom 0.152: JP3.17 26.71,19.78 26.8,19.86 27.53,19.86 v28.19,20.52
RCVR_MODE  (via drill 0.33)
  Top 0.152: v28.65,17.55 28.12,17.55 27.89,17.32 26.92,17.32 26.58,16.98 JP3.31
  Bottom 0.152: JP3.31 26.58,16.98 26.92,17.32 27.89,17.32 28.12,17.55 v28.65,17.55
RESET_OUT#  (via drill 0.33)
  Top 0.152: JP3.36 22.25,16.18 21.82,15.75 20.5,15.75 v20.27,15.98
  Bottom 0.152: v20.27,15.98 20.5,15.75 21.82,15.75 22.25,16.18 JP3.36
USB_DN  (via drill 0.33)
  Top 0.152: JP3.18 22.61,19.78 22.48,19.91 19.61,19.91 18.97,20.55 v18.97,21.01
  Bottom 0.152: v18.97,21.01 18.97,20.55 19.61,19.91 22.48,19.91 22.61,19.78 JP3.18
USB_DP  (via drill 0.33)
  Top 0.152: JP3.16 22.67,20.18 22.5,20.34 20.12,20.34 v19.89,20.57
  Bottom 0.152: v19.89,20.57 20.12,20.34 22.5,20.34 22.67,20.18 JP3.16
USB_ID  (via drill 0.33)
  Top 0.152: v27.51,22.86 27.23,22.58 JP3.3
  Bottom 0.152: JP3.3 27.23,22.58 v27.51,22.86
USB_VBUS  (via drill 0.33)
  Top 0.152: v18.59,19.99 18.97,19.61 22.23,19.61 22.45,19.38 JP3.20
  Bottom 0.152: JP3.20 22.45,19.38 22.23,19.61 18.97,19.61 v18.59,19.99
V_BAT_BKUP  (via drill 0.33)
  Top 0.152: v28.45,18.87 28.37,18.95 27.18,18.95 26.81,18.58 JP3.23
  Bottom 0.152: JP3.23 26.81,18.58 27.18,18.95 28.37,18.95 v28.45,18.87
VREF  (via drill 0.51)
  Top 0.254: U3.5 21.04,28.96 21.04,29.43 21.34,29.72 21.34,30.23 | R7.2 21.3,30.27 21.34,30.23 | 21.34,30.23 21.34,33.66 v20.83,34.16
  Bottom 0.254: JP1.8 24.13,41.91 22.86,40.64 20.83,40.64 | 20.83,40.64 15.11,40.64 13.97,41.78 JP1.4 | v20.83,34.16 20.83,40.64
VSYS  (via drill 0.33, 0.51)
  Top 0.152: 22.35,22.61 22.35,22.35 22.52,22.18 22.86,22.18 | 22.35,22.61 22.35,22.86 22.47,22.98 | 22.47,22.98 | JP3.2 22.47,22.98 | JP3.6 22.86,22.18 | JP3.6 | JP3.6 22.86,22.18 | 22.86,22.18 | JP3.4 22.38,22.58 22.35,22.61
  Top 0.254: U1.8 12.95,33.02 13.12,32.85 C1.1 13.12,28.23 12.7,27.81 v9.53,27.81 | R1.2 16.09,21.93 16.51,22.35 v16.51,24.13 18.8,24.13 | C2.1 7.62,15.49 7.87,15.24 R3.2 8.68,16.04 9.14,16.51 9.78,16.51 10.54,17.27 10.54,19.01 R2.2 10.58,21.17 9.34,22.41 SJ2.2 9.34,25.47 v9.53,25.65 | JP3.4 21.83,22.58 v21.19,23.22 | 18.8,24.13 20.28,24.13 v21.19,23.22 | v21.19,23.22 v21.18,23.22 | 18.8,24.13 18.8,25.31 C4.1 18.51,25.6 18.51,26.92 | U3.3 18.51,26.92 | U3.1 19.37,28.89 19.56,28.7 19.56,27.18 19.3,26.92 18.51,26.92
  Bottom 0.152: JP3.2 22.47,22.98 22.35,22.86 22.35,22.58 22.35,22.35 22.52,22.18 | JP3.6 22.52,22.18 | JP3.6 | JP3.6 22.52,22.18 | 22.52,22.18
  Bottom 0.254: v9.53,27.81 v9.53,25.65 9.53,24.51 9.91,24.13 v16.51,24.13 | v21.18,23.22 21.82,22.58 22.35,22.58 JP3.4

### Text on the board
Top: v21
tPlace: AIN3 | GND | AIN2 | 3.3V | AIN1 | GND | AIN0 | 3.3V | ADC Block | I2C ADDR / CLOSE ONE / ONLY | 0x48 | 0x49 | 0x4A | 0x4B | I2C-1 | I2C-6 | DIFF / CH + - / 0 0 1 / 1 0 3 / 2 1 3 / 3 2 3
bPlace: AIN3 | GND | AIN2 | 3.3V | AIN1 | GND | AIN0 | 3.3V | ADC Block | 4xM2.0 | DIFF / CH + - / 0 0 1 / 1 0 3 / 2 1 3 / 3 2 3
Measures: x6
tDocu: NOTES: / - Units are in inches / - PCB thickness = 0.032" / - Use Casey_Edison-2-Layer.dru | M Hord | Revised 3/15 - Casey Kuhns | Revised 10/15 - Shawn Hymel